# Altium schematic sheet Block_Diagram.SchDoc
size A4; Author: Van Hieu; Organization: BACH-KHOA-DK; Gmail: maivanhieu24042003@gmail.com
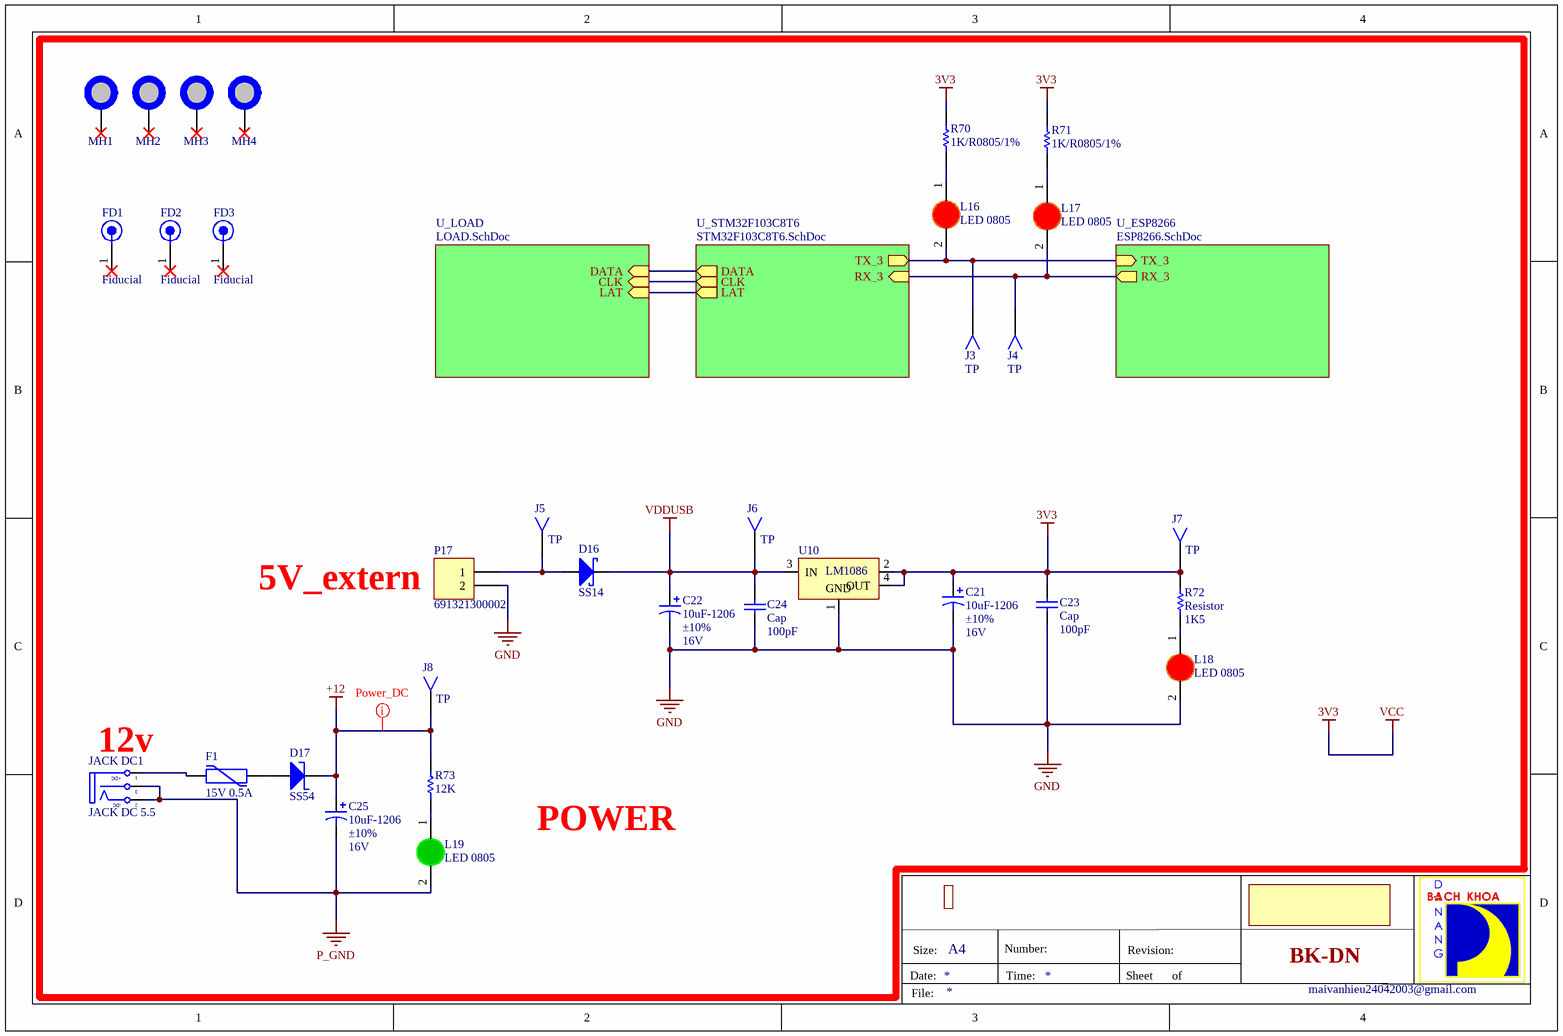
[diagram p0: Block_Diagram.SchDoc]

## Parts
C21  10uF-1206  Tolerance: ±10%  Voltage - Rated: 16V  [CAP1206_TANTALUM_YELLOW]
C22  10uF-1206  Tolerance: ±10%  Voltage - Rated: 16V  [CAP1206_TANTALUM_YELLOW]
C23  Cap  value 100pF  [CAPC2012L]
C24  Cap  value 100pF  [CAPC2012L]
C25  10uF-1206  Tolerance: ±10%  Voltage - Rated: 16V  [CAP1206_TANTALUM_YELLOW]
D16  SS14  [DIODE SMD]
D17  SS54  [DO-214AB/SMC]
F1  15V 0.5A  [FUSE_PTC_SMD1812_02]
FD1  Fiducial  [FIDUCIAL_TOP]
FD2  Fiducial  [FIDUCIAL_TOP]
FD3  Fiducial  [FIDUCIAL_TOP]
J3  TP  [TEST_POINT_1.0X1.0MM]
J4  TP  [TEST_POINT_1.0X1.0MM]
J5  TP  [TEST_POINT_1.0X1.0MM]
J6  TP  [TEST_POINT_1.0X1.0MM]
J7  TP  [TEST_POINT_1.0X1.0MM]
J8  TP  [TEST_POINT_1.0X1.0MM]
JACK_DC1  JACK DC 5.5  [JACK DC 5.5]
L16  LED 0805  [LED-RED-0805]
L17  LED 0805  [LED-RED-0805]
L18  LED 0805  [LED-RED-0805]
L19  LED 0805  [LED-GREEN-0805]
MH1  MH_3MMC_2.1MMD  [MH_3MMD_2.1MMD]  (value not drawn)  (no BOM)
MH2  MH_3MMC_2.1MMD  [MH_3MMD_2.1MMD]  (value not drawn)  (no BOM)
MH3  MH_3MMC_2.1MMD  [MH_3MMD_2.1MMD]  (value not drawn)  (no BOM)
MH4  MH_3MMC_2.1MMD  [MH_3MMD_2.1MMD]  (value not drawn)  (no BOM)
P17  691321300002  [TERMINAL_KF2EDGV_F_1X2_3.81]
R70  1K/R0805/1%  [Res 0805 SMD]
R71  1K/R0805/1%  [Res 0805 SMD]
R72  Resistor  value 1K5  [RESC2012L]
R73  value 12K  [RESC2012L]  (hidden comment: Resistor)
U10  LM1086  [LM1086]

## Sub-sheets
U_ESP8266 = ESP8266.SchDoc: RX_3 (out), TX_3 (in)
U_LOAD = LOAD.SchDoc: DATA (in), CLK (in), LAT (in)
U_STM32F103C8T6 = STM32F103C8T6.SchDoc: RX_3 (in), TX_3 (out), DATA (out), CLK (out), LAT (out)

## Nets
3V3: C21.1 C23.1 J7.1 R70.2 R71.2 R72.1 U10.2(OUT) U10.4(OUT)  [also labelled VCC]
+12: C25.1 D17.2(K) J8.1 R73.2
GND: C21.2 C22.2 C23.2 C24.2 L18.2(K) P17.2 U10.1(GND)
P_GND: C25.2 JACK_DC1.2(TN) JACK_DC1.3(S) L19.2(K)
VDDUSB: C22.1 C24.1 D16.2(K) J6.1 U10.3(IN)
NetD16_1: D16.1(A) J5.1 P17.1
NetD17_1: D17.1(A) F1.2
NetF1_1: F1.1 JACK_DC1.1(T)
NetJ3_1: J3.1 L16.2(K) ; sheet U_ESP8266/TX_3, sheet U_STM32F103C8T6/TX_3
NetJ4_1: J4.1 L17.2(K) ; sheet U_ESP8266/RX_3, sheet U_STM32F103C8T6/RX_3
NetL16_1: L16.1(A) R70.1
NetL17_1: L17.1(A) R71.1
NetL18_1: L18.1(A) R72.2
NetL19_1: L19.1(A) R73.1
(unnamed): sheet U_LOAD/DATA, sheet U_STM32F103C8T6/DATA
(unnamed): sheet U_LOAD/CLK, sheet U_STM32F103C8T6/CLK
(unnamed): sheet U_LOAD/LAT, sheet U_STM32F103C8T6/LAT

Not connected (* = marked no-connect by the designer): FD1 1*; FD2 1*; FD3 1*; MH1 1*; MH2 1*; MH3 1*; MH4 1*

## Layout directives
power_DC: power_DC: +12

## Notes on the sheet
- (near P17) 5V_extern
- (near JACK_DC1) 12v
- POWER
- Van Hieu
- Date:
- Size:
- A4
- Number:
- Time:
- Sheet
- Revision:
- of
- BK-DN
- File:
- maivanhieu24042003@gmail.com
- (in symbol JACK DC 5.5) +DC; -DC

## Library data of the parts
C21 C22 C25 = T491A106K016AT: CAP TANT 10UF 16V 10% 1206; Manufacturer 1: KEMET; Manufacturer Size Code: A; Category 1: Capacitors; Capacitance: 10µF; Type: Molded; ESR (Equivalent Series Resistance): 7 Ohm; Lifetime @ Temp.: 2000 Hrs @ 85°C; Supplier 1: Digi-Key; Supplier Part Number 1: 399-8269-1-ND; Manufacturer Part Number 1: T491A106K016AT; RoHS 1: RoHS Compliant; Description 1: CAP TANT 10UF 16V 10% 1206; Stock 1: 54083; Pricing 1: 1=0.45, 10=0.312, 100=0.1873, 500=0.14048, 1000=0.11862 (USD); Packaging: Cut Tape (CT); Part Status: Active; Operating Temperature: -55°C ~ 125°C; Mounting Type: Surface Mount; Package / Case: 1206 (3216 Metric); Size / Dimension: 0.126" L x 0.063" W (3.20mm x 1.60mm); Height - Seated (Max): 0.071" (1.80mm); Lead Spacing: -; Features: General Purpose; Failure Rate: -; ComponentLink1URL: http://www.kemet.com/Lists/ProductCatalog/Attachments/254/KEM_T2005_T491.pdf; ComponentLink1Description: http://www.kemet.com/Lists/ProductCatalog/Attachments/254/KEM_T2005_T491.pdf; Value: 10uF
C23 C24 = Cap: Capacitor; Published: 8-Jun-2000; LatestRevisionDate: 17-Jul-2002; LatestRevisionNote: Re-released for DXP Platform.; PackageReference: RAD-0.3; Publisher: Altium Limited
D16 = Diode SS14 ( 1N5819): Dán; Ma_Hang: MH002211; Don_Vi: Con; So_Chan: 2; Kieu_Chan: DO214; Ten_Linh_Kien: Diode SS14 DO214 Schottky 1A 40V ( 1N5819 DO214); Chung_Loai: Dán
D17 = Diode Schottky: Buy Link: https://www.thegioiic.com/products/ss54-smc
F1 = FUSE_MF-MSMF050-2: BOURNS         MF-MSMF110/16-2            FUSE, RESETTABLE PTC, 16V, 1.1A, 1812, FULL REEL; Number of Terminals/Pins: 2; Max Current Rating: 100A; Power Dissipation: 800mW; Hold Current: 500mA; Trip Current: 1A; Resistance: 150mR; Time to Trip: 0.15s; Aging: 1000 hr @ +85 °C (Passive); Approvals: UL,CSA,TUV; Supplier 1: Digi-Key; Supplier Part Number 1: MF-MSMF050-2TR-ND; Manufacturer: Bourns; Manufacturer Part Number: MF-MSMF050-2; RoHS: Yes; Category: Fuses; Stock 1: 20000; Pricing 1: 2000=0.15300, 4000=0.14400, 6000=0.13500, 10000=0.12600 (USD); Mount: Surface Mount,PCB; Case/Package: 1812; Number of Pins: 2; Case Code (Metric): 4532; Case Code (Imperial): 1812; Contact Plating: Gold; Terminal Material: Gold; Min Operating Temperature: -40°C; Max Operating Temperature: 85°C; Package Quantity: 2000; Packaging: Tape and Reel; Voltage Rating: 15V; Operating Supply Voltage: 15V; Current Rating: 100A; Termination: SMD/SMT; Voltage Rating (DC): 15V; Series: MF-MSMF; Length: 4.73mm; Width: 3.41mm; Height: 0.85mm; Radiation Hardening: No; REACH SVHC: No SVHC; Lead Free: Lead Free; RoHS Compliant: Yes; ComponentLink1URL: https://datasheet.ciiva.com/34302/1164200-34302041.pdf?src-supplier=Jameco; ComponentLink1Description: https://datasheet.ciiva.com/34302/1164200-34302041.pdf?src-supplier=Jameco; ComponentLink2URL: https://datasheet.ciiva.com/326/mfmsmf-326354.pdf?src-supplier=Digi-Key; ComponentLink2Description: https://datasheet.ciiva.com/326/mfmsmf-326354.pdf?src-supplier=Digi-Key; ComponentLink3URL: https://datasheet.ciiva.com/1228/1786007-1228155.pdf?src-supplier=Newark; ComponentLink3Description: https://datasheet.ciiva.com/1228/1786007-1228155.pdf?src-supplier=Newark; ComponentLink4URL: https://datasheet.ciiva.com/16205/mfmsmf-16205994.pdf?src-supplier=Onlinecomponents.com; ComponentLink4Description: https://datasheet.ciiva.com/16205/mfmsmf-16205994.pdf?src-supplier=Onlinecomponents.com; ComponentLink5URL: https://datasheet.ciiva.com/14537/70153434-14537737.pdf?src-supplier=Allied+Electronics; ComponentLink5Description: https://datasheet.ciiva.com/14537/70153434-14537737.pdf?src-supplier=Allied+Electronics; ComponentLink6URL: https://datasheet.ciiva.com/46395/1695373-46395287.pdf?src-supplier=Element14; ComponentLink6Description: https://datasheet.ciiva.com/46395/1695373-46395287.pdf?src-supplier=Element14; ComponentLink7URL: https://datasheet.ciiva.com/22749/1695373-22749079.pdf?src-supplier=Element14; ComponentLink7Description: https://datasheet.ciiva.com/22749/1695373-22749079.pdf?src-supplier=Element14; ComponentLink8URL: https://datasheet.ciiva.com/32426/mf-msmf-series-eng-tds-32426126.pdf?src-supplier=Distrelec; ComponentLink8Description: https://datasheet.ciiva.com/32426/mf-msmf-series-eng-tds-32426126.pdf?src-supplier=Distrelec; ComponentLink9URL: https://datasheet.ciiva.com/4501/mfmsmf-72300-4501655.pdf?src-supplier=Mouser; ComponentLink9Description: https://datasheet.ciiva.com/4501/mfmsmf-72300-4501655.pdf?src-supplier=Mouser; ComponentLink10URL: https://datasheet.ciiva.com/3019/mfmsmf-3019622.pdf?src-supplier=Avnet; ComponentLink10Description: https://datasheet.ciiva.com/3019/mfmsmf-3019622.pdf?src-supplier=Avnet; ComponentLink11URL: https://datasheet.ciiva.com/3019/mfmsmf-3019621.pdf?src-supplier=Avnet; ComponentLink11Description: https://datasheet.ciiva.com/3019/mfmsmf-3019621.pdf?src-supplier=Avnet; ComponentLink12URL: https://datasheet.ciiva.com/326/mfmsmf-326356.pdf?src-supplier=Digi-Key; ComponentLink12Description: https://datasheet.ciiva.com/326/mfmsmf-326356.pdf?src-supplier=Digi-Key; ComponentLink13URL: https://datasheet.ciiva.com/1274/1786007-1274499.pdf?src-supplier=Element14; ComponentLink13Description: https://datasheet.ciiva.com/1274/1786007-1274499.pdf?src-supplier=Element14; ComponentLink14URL: https://datasheet.ciiva.com/326/mfmsmf-326355.pdf?src-supplier=Digi-Key; ComponentLink14Description: https://datasheet.ciiva.com/326/mfmsmf-326355.pdf?src-supplier=Digi-Key; ComponentLink15URL: https://datasheet.ciiva.com/1274/1786007-1274498.pdf?src-supplier=Element14; ComponentLink15Description: https://datasheet.ciiva.com/1274/1786007-1274498.pdf?src-supplier=Element14; ComponentLink16URL: https://datasheet.ciiva.com/15226/getdatasheetpartid-117168-15226886.pdf?src-supplier=Verical; ComponentLink16Description: https://datasheet.ciiva.com/15226/getdatasheetpartid-117168-15226886.pdf?src-supplier=Verical; ComponentLink17URL: https://datasheet.ciiva.com/25894/mfmsmf-25894175.pdf?src-supplier=Avnet+Europe; ComponentLink17Description: https://datasheet.ciiva.com/25894/mfmsmf-25894175.pdf?src-supplier=Avnet+Europe; Supplier 2: Digi-Key; Supplier Part Number 2: MF-MSMF110/16-2TR-ND; Stock 2: 8000; Pricing 2: 2000=0.16800, 4000=0.16500, 6000=0.16200, 10000=0.15960 (USD); Max Power Dissipation: 800mW; ComponentLink18URL: https://datasheet.ciiva.com/16206/mfmsmf-16206000.pdf?src-supplier=Onlinecomponents.com; ComponentLink18Description: https://datasheet.ciiva.com/16206/mfmsmf-16206000.pdf?src-supplier=Onlinecomponents.com; ComponentLink19URL: https://datasheet.ciiva.com/34302/1164242-34302042.pdf?src-supplier=Jameco; ComponentLink19Description: https://datasheet.ciiva.com/34302/1164242-34302042.pdf?src-supplier=Jameco; ComponentLink20URL: https://datasheet.ciiva.com/326/mfmsmf-326551.pdf?src-supplier=Digi-Key; ComponentLink20Description: https://datasheet.ciiva.com/326/mfmsmf-326551.pdf?src-supplier=Digi-Key; ComponentLink21URL: https://datasheet.ciiva.com/1274/1786007-1274504.pdf?src-supplier=Element14; ComponentLink21Description: https://datasheet.ciiva.com/1274/1786007-1274504.pdf?src-supplier=Element14; ComponentLink22URL: https://datasheet.ciiva.com/326/mfmsmf-326553.pdf?src-supplier=Digi-Key; ComponentLink22Description: https://datasheet.ciiva.com/326/mfmsmf-326553.pdf?src-supplier=Digi-Key; ComponentLink23URL: https://datasheet.ciiva.com/1274/1786007-1274505.pdf?src-supplier=Element14; ComponentLink23Description: https://datasheet.ciiva.com/1274/1786007-1274505.pdf?src-supplier=Element14; ComponentLink24URL: https://datasheet.ciiva.com/17401/mfmsmf-17401721.pdf?src-supplier=Avnet+Europe; ComponentLink24Description: https://datasheet.ciiva.com/17401/mfmsmf-17401721.pdf?src-supplier=Avnet+Europe; ComponentLink25URL: https://datasheet.ciiva.com/30134/575mfmsmf-30134057.pdf?src-supplier=Onlinecomponents.com; ComponentLink25Description: https://datasheet.ciiva.com/30134/575mfmsmf-30134057.pdf?src-supplier=Onlinecomponents.com; ComponentLink26URL: https://datasheet.ciiva.com/3020/mfmsmf-3020011.pdf?src-supplier=Avnet; ComponentLink26Description: https://datasheet.ciiva.com/3020/mfmsmf-3020011.pdf?src-supplier=Avnet; ComponentLink27URL: https://datasheet.ciiva.com/3019/mfmsmf-3019628.pdf?src-supplier=Avnet; ComponentLink27Description: https://datasheet.ciiva.com/3019/mfmsmf-3019628.pdf?src-supplier=Avnet; ComponentLink28URL: https://datasheet.ciiva.com/1228/1786007-1228158.pdf?src-supplier=Newark; ComponentLink28Description: https://datasheet.ciiva.com/1228/1786007-1228158.pdf?src-supplier=Newark; ComponentLink29URL: https://datasheet.ciiva.com/28411/1695373-28411566.pdf?src-supplier=Element14; ComponentLink29Description: https://datasheet.ciiva.com/28411/1695373-28411566.pdf?src-supplier=Element14; ComponentLink30URL: https://datasheet.ciiva.com/326/mfmsmf-326552.pdf?src-supplier=Digi-Key; ComponentLink30Description: https://datasheet.ciiva.com/326/mfmsmf-326552.pdf?src-supplier=Digi-Key; ComponentLink31URL: https://datasheet.ciiva.com/14538/70153434-14538680.pdf?src-supplier=Allied+Electronics; ComponentLink31Description: https://datasheet.ciiva.com/14538/70153434-14538680.pdf?src-supplier=Allied+Electronics; ComponentLink32URL: https://datasheet.ciiva.com/15187/getdatasheetpartid-115224-15187116.pdf?src-supplier=Verical; ComponentLink32Description: https://datasheet.ciiva.com/15187/getdatasheetpartid-115224-15187116.pdf?src-supplier=Verical
J3-J8 = TEST POINT 1.0X1.0: Manufacturer 1: Bourns Inc.; Manufacturer Part Number 1: PTV09A-4020U-B103; Description 1: POT 10K OHM 1/20W CARBON LINEAR; Category 1: Potentiometers, Variable Resistors; Resistance (Ohms): 10k; Tolerance: ±20%; Built in Switch: None; Power (Watts): 0.05W, 1/20W; Number of Turns: 1; Rotation: 280°; Adjustment Type: Top Adjustment; Resistive Material: Carbon; Actuator Type: Knurled; Actuator Length: 0.787" (20.00mm); Actuator Diameter: 0.236" (6.00mm); Supplier 1: Digi-Key; Supplier Part Number 1: PTV09A-4020U-B103-ND; RoHS 1: RoHS Compliant; Stock 1: 414; Pricing 1: 1=0.83, 10=0.744, 25=0.672, 50=0.648, 100=0.612, 250=0.588, 500=0.552, 1000=0.456, 5000=0.372 (USD); Packaging: Tray; Part Status: Active; Taper: Linear; Temperature Coefficient: -; Termination Style: PC Pins, Board Locks; Bushing Thread: -; Mounting Type: Through Hole, Snap In; ComponentLink1URL: http://www.bourns.com/docs/Product-Datasheets/PTV09.pdf; ComponentLink1Description: http://www.bourns.com/docs/Product-Datasheets/PTV09.pdf
JACK_DC1 = JACK DC 5.5: Value: Jac DC
L16-L18 = LED RED 0805: SMD; Don_Vi: Con; Chung_Loai: Dán; Ma_Hang: MH000897; Ten_Linh_Kien: LED 0805 Màu Đỏ (Red); Ghi_Chu: *; Kieu_Chan: *
L19 = LED GREEN 0805: SMD; Don_Vi: Con; Chung_Loai: Dán; Ma_Hang: MH000897; Ten_Linh_Kien: LED 0805 Màu Đỏ (Red); Ghi_Chu: *; Kieu_Chan: *
MH1-MH4 = MH_3MMC_2.1MMD: Mounting Hole 3mm Diameter, 2.1mm Drill
P17 = TERMINAL_KF2EDGV_F_1X2_3.81: TERM BLOCK HDR 2POS VERT 3.81MM; Manufacturer: Wurth Electronics Inc.; Number of Positions: 2; Number of Levels: 1; Pitch: 0.150" (3.81mm); Header Orientation: Vertical; Material Flammability Rating: UL94 V-0; Contact Tail Length: 0.138" (3.50mm); Supplier 1: Digi-Key; Manufacturer Part Number: 691321300002; RoHS: RoHS Compliant; Category: Connectors, Interconnects; Stock 1: 2512; Pricing 1: 1=0.33, 10=0.296, 50=0.255, 100=0.2375 (USD); Packaging: Bulk; Part Status: Active; Type: Header, Male Pins, Shrouded (4 Side); Positions Per Level: 2; Plug Wire Entry: -; Termination Style: Solder; Mounting Type: Through Hole; Current - IEC: -; Wire Gauge or Range - AWG: -; Wire Gauge or Range - mm²: -; Color: Green; Operating Temperature: -40°C ~ 105°C; Contact Mating Finish: Tin; Features: -; Ingress Protection: -; Screw Size: -; Torque - Screw: -; Wire Strip Length: -; Contact Material: Brass; Housing Material: Polyamide (PA66), Nylon 6/6; Insulation Height: 0.362" (9.20mm); ComponentLink1URL: http://katalog.we-online.de/em/datasheet/6913213000xx.pdf; ComponentLink1Description: http://katalog.we-online.de/em/datasheet/6913213000xx.pdf; Supplier Part Number 1: 732-2082-ND
R70 R71 = 34.8K/R0805/1%_3: 1 kOhms ±1% 0.125W, 1/8W Chip Resistor 0805 (2012 Metric) Automotive AEC-Q200 Thick Film; Power Rating: 100mW; Resistance: 34.8kR; Voltage Rating: 50V; Case/Package: 0603; Case Code (Imperial): 0603; Case Code (Metric): 1608; Min Operating Temperature: -55°C; Max Operating Temperature: 155°C; Termination: SMD/SMT; Military Standard: Not; Voltage Rating (DC): 50V; Length: 1.6mm; Height: 0.45mm; Width: 0.8mm; Depth: 0.8mm; Lead Free: Lead Free; Digikey: 541-1.00KCCT-ND
R72 R73 = Resistor: Semiconductor Resistor; Published: 8-Jun-2000; LatestRevisionDate: 17-Jul-2002; LatestRevisionNote: Re-released for DXP Platform.; PackageReference: AXIAL-0.5; Publisher: Altium Limited
U10 = LM1086: Linear Voltage Regulator 3V3 1.5A 24V Max TO-220; ComponentLink1Description: Datasheet; ComponentLink1URL: D:\Dropbox\Datasheets\Power Management ICs\Linear Regulators\LM78XX.pdf; Unit Price: 0.3000